# EAGLE board loa_carrier_motorcontrol (EAGLE 5.11), part 1 of 2
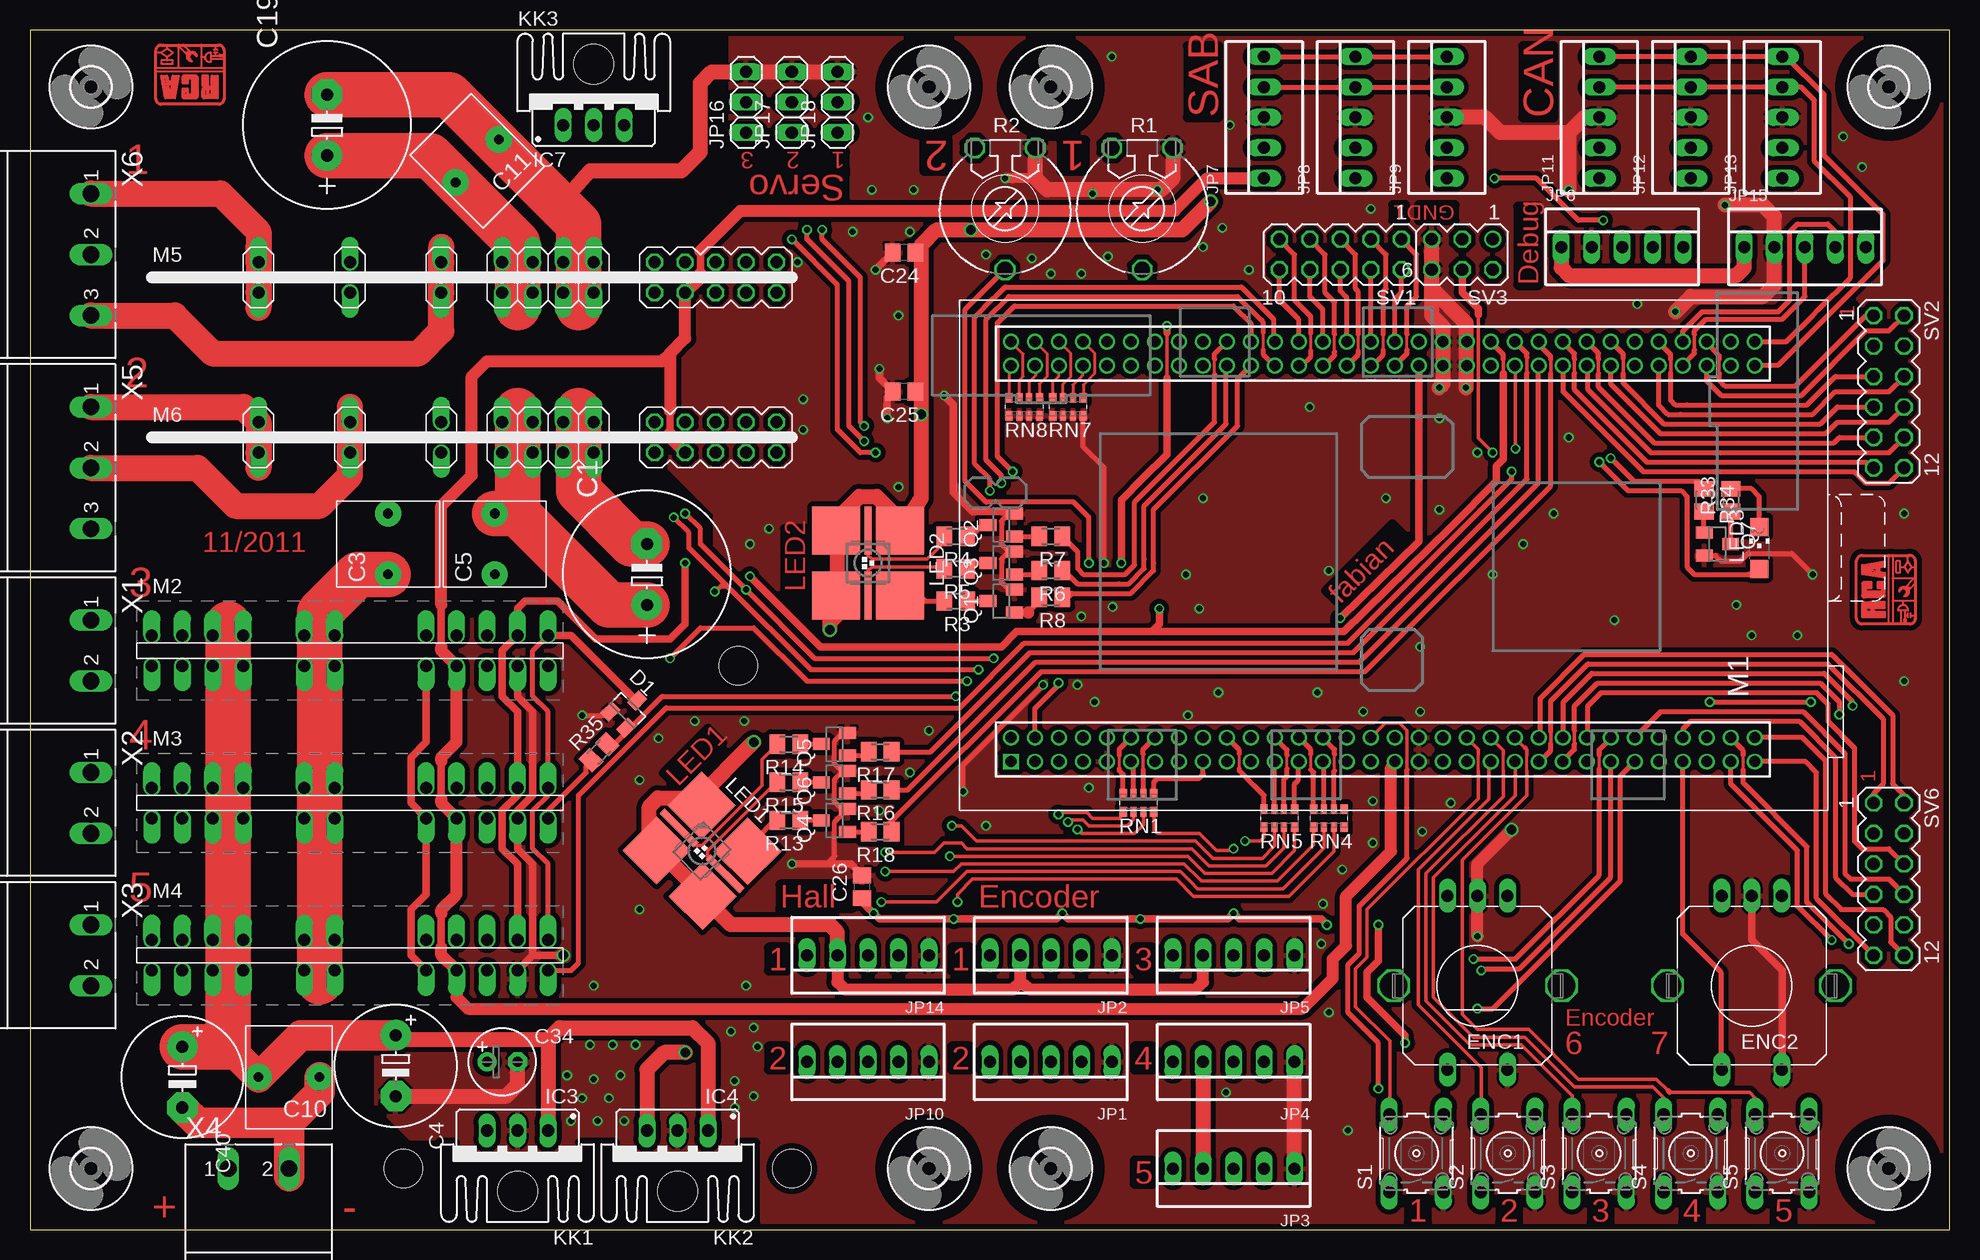
[diagram p7: board, top side]
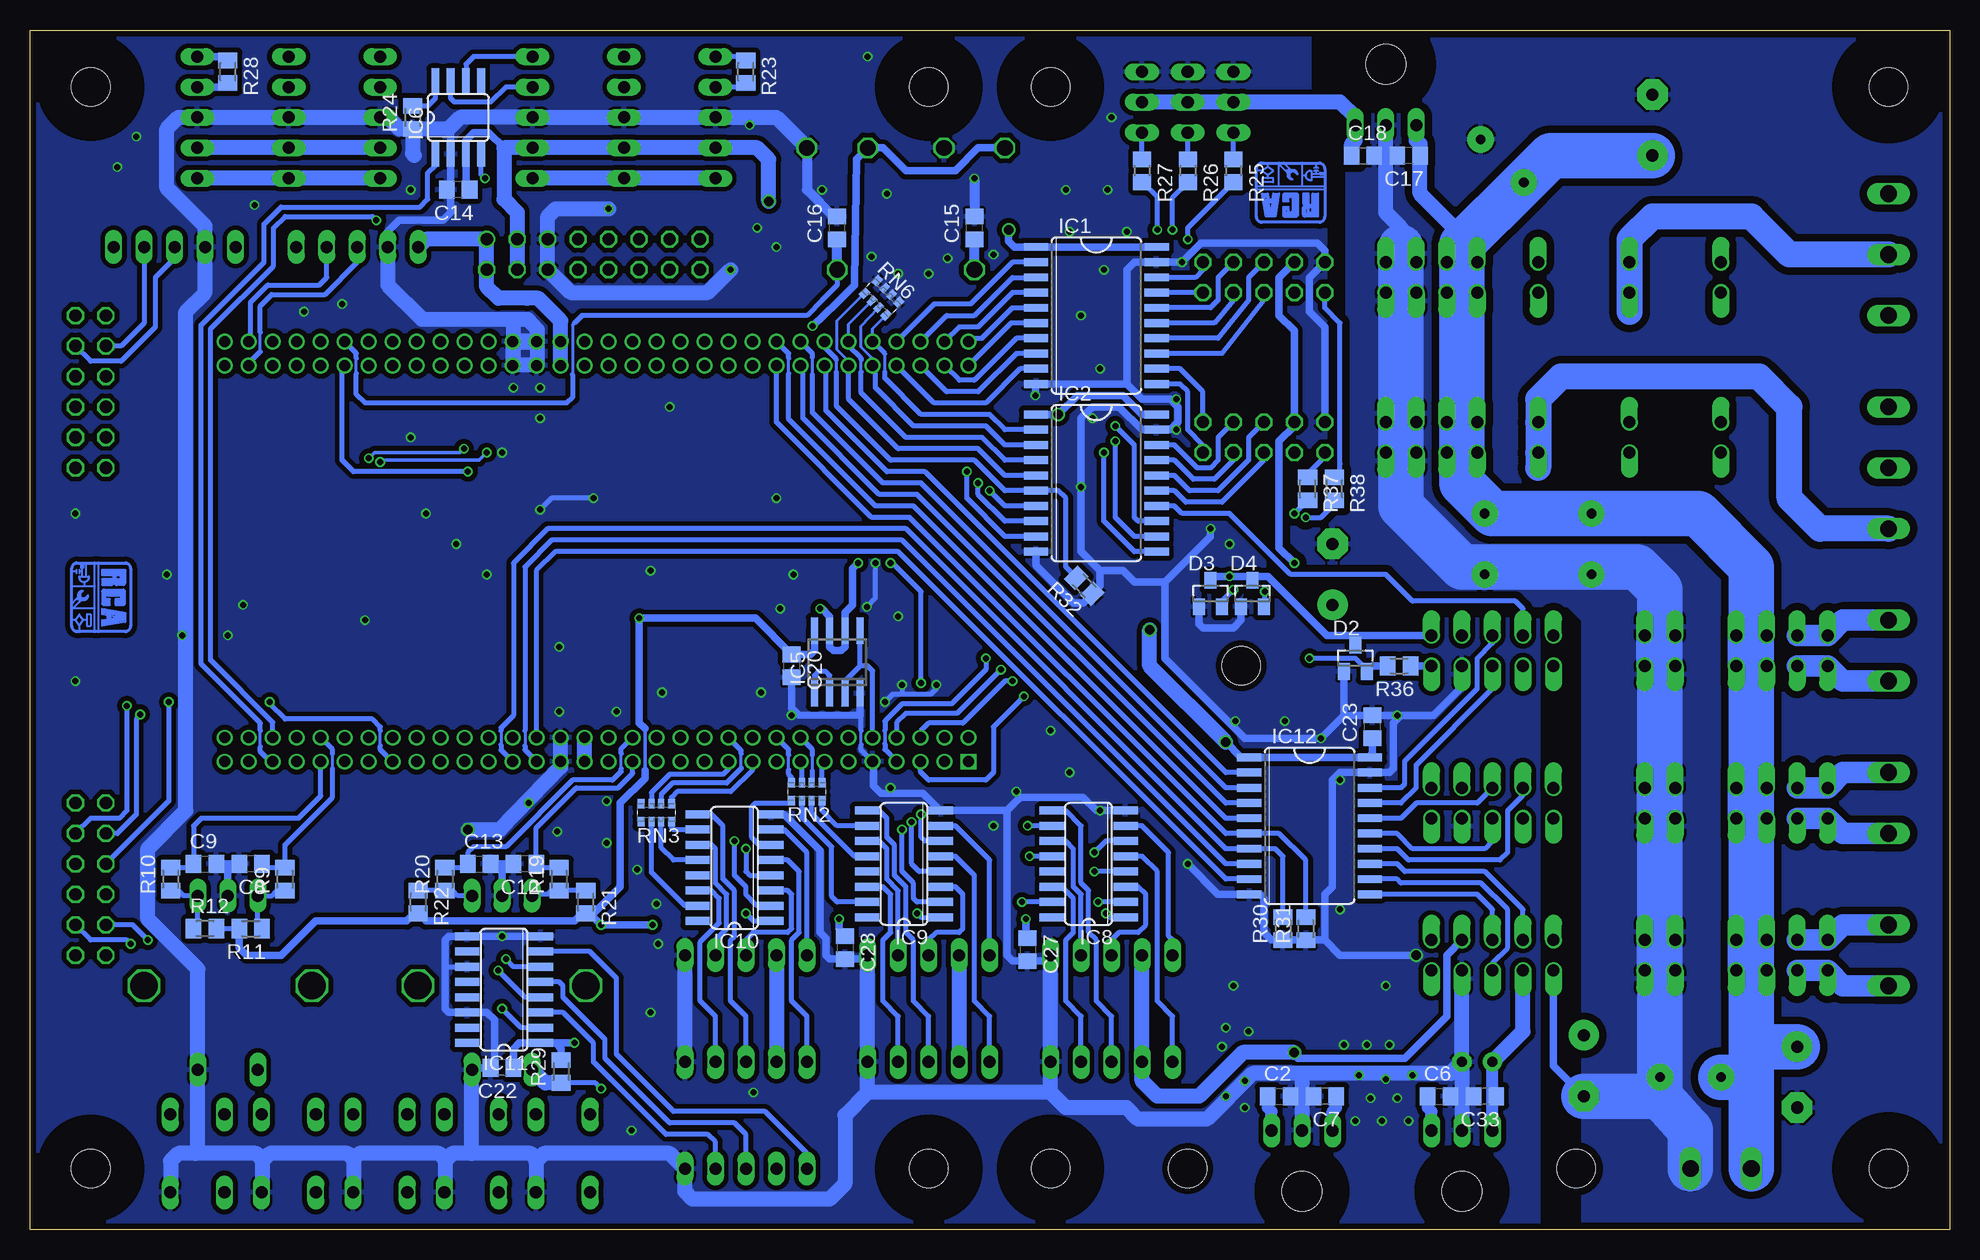
[diagram p8: board, bottom side, seen from below]

Size 160 x 100 mm. Coordinates in mm from the lower left corner, seen from the top.
Outline: 0,0 160,0 160,100 0,100 0,0
Copper layers (1*16): Top 0.035mm / dielectric 1.5mm / Bottom 0.035mm
Design rules "PCB-POOL": minimum track width 6mil, minimum drill 12mil, track to track 6mil, track to pad 6mil, pad to pad 6mil, via to via 6mil, smd to smd 6mil, copper to edge 20mil, drill to drill 8mil, minimum pad ring 8mil, minimum via ring 6mil, stop-mask expansion 3mil, vias tented up to drill 0mil, thermal gap 8mil
Holes 3.2 mm at 59.05,46.99 31.11,5.08 63.5,5.08
tRestrict: 2 lines

## Footprints (pad centres in the part's own frame; a part is rotated, then mirrored left to right if it is on the bottom)
E5-13 = drill 1.016 pad 2.54 round: + -2.54,0 | drill 1.016 pad 2.54 octagon: - 2.54,0
C0805 = smd 1.3 x 1.5: 1 -0.95,0; 2 0.95,0
MKS-2-8572 = drill 0.8 pad 2.184 round: 1 0,2.54; 2 0,-2.54
E5-10,5 = drill 1.016 pad 2.54 round: + -2.54,0 | drill 1.016 pad 2.54 octagon: - 2.54,0
E2,5-6 = drill 0.813 pad 1.6 round: + -1.27,0 | drill 0.813 pad 1.6 octagon: - 1.27,0
SOT23 = smd 1 x 1.4: 1 -0.95,-1.1; 2 0.95,-1.1; 3 0,1.1
EC12E24244 = drill 1 long: A -2.5,-7.5; B 2.5,-7.5; C 0,-7.5; D -2.5,7; E 2.5,7 | drill 2.3 octagon: CASE1 -7,0; CASE2 7,0
SO20W = smd 0.66 x 2.032: 1 -5.715,-5.029; 2 -4.445,-5.029; 3 -3.175,-5.029; 4 -1.905,-5.029; 5 -0.635,-5.029; 6 0.635,-5.029; 7 1.905,-5.029; 8 3.175,-5.029; 9 4.445,-5.029; 10 5.715,-5.029; 11 5.715,5.029; 12 4.445,5.029; 13 3.175,5.029; 14 1.905,5.029; 15 0.635,5.029; 16 -0.635,5.029; 17 -1.905,5.029; 18 -3.175,5.029; 19 -4.445,5.029; 20 -5.715,5.029
78XXS = drill 1.016 long: GND 0,-2.54; IN -2.54,-2.54; OUT 2.54,-2.54
SO08 = smd 0.6 x 2.2: 1 -1.905,-2.6; 2 -0.635,-2.6; 3 0.635,-2.6; 4 1.905,-2.6; 5 1.905,2.6; 6 0.635,2.6; 7 -0.635,2.6; 8 -1.905,2.6
SOIC-8 = smd 2.032 x 0.66: 1 -3.073,1.27; 2 -3.073,0; 3 -3.073,-1.27; 4 -3.073,-2.54; 5 3.073,-2.54; 6 3.073,-1.27; 7 3.073,0; 8 3.073,1.27
SO16 = smd 0.66 x 2.032: 1 -4.445,-3.073; 2 -3.175,-3.073; 3 -1.905,-3.073; 4 -0.635,-3.073; 5 0.635,-3.073; 6 1.905,-3.073; 7 3.175,-3.073; 8 4.445,-3.073; 9 4.445,3.073; 10 3.175,3.073; 11 1.905,3.073; 12 0.635,3.073; 13 -0.635,3.073; 14 -1.905,3.073; 15 -3.175,3.073; 16 -4.445,3.073
22-23-2051 = drill 1 long: 1 -5.08,0; 2 -2.54,0; 3 0,0; 4 2.54,0; 5 5.08,0
1X03 = drill 1.016 long: 1 -2.54,0; 2 0,0; 3 2.54,0
SK95-2M3 = hole 3.302: 0,2.54
P-LCC-6 = smd 4 x 4: 1 -2.65,-2.7; 3 2.65,-2.7; 4 2.65,2.7; 6 -2.65,2.7 | smd 0.6 x 4: 2 0,-2.7; 5 0,2.7
CHIPLED_1206 = smd 1.5 x 1.5: A 0,-1.75; C 0,1.75
CONTROL = drill 0.914 square: 1 4.08,68.1 | drill 0.914 round: 2 6.08,68.1; 3 4.08,66.1; 4 6.08,66.1; 5 4.08,64.1; 6 6.08,64.1; 7 4.08,62.1; 8 6.08,62.1; 9 4.08,60.1; 10 6.08,60.1; 11 4.08,58.1; 12 6.08,58.1; 13 4.08,56.1; 14 6.08,56.1; 15 4.08,54.1; 16 6.08,54.1; 17 4.08,52.1; 18 6.08,52.1; 19 4.08,50.1; 20 6.08,50.1; 21 4.08,48.1; 22 6.08,48.1; 23 4.08,46.1; 24 6.08,46.1; 25 4.08,44.1; 26 6.08,44.1; 27 4.08,42.1; 28 6.08,42.1; 29 4.08,40.1; 30 6.08,40.1; 31 4.08,38.1; 32 6.08,38.1; 33 4.08,36.1; 34 6.08,36.1; 35 4.08,34.1; 36 6.08,34.1; 37 4.08,32.1; 38 6.08,32.1; 39 4.08,30.1; 40 6.08,30.1; 41 4.08,28.1; 42 6.08,28.1; 43 4.08,26.1; 44 6.08,26.1; 45 4.08,24.1; 46 6.08,24.1; 47 4.08,22.1; 48 6.08,22.1; 49 4.08,20.1; 50 6.08,20.1; 51 4.08,18.1; 52 6.08,18.1; 53 4.08,16.1; 54 6.08,16.1; 55 4.08,14.1; 56 6.08,14.1; 57 4.08,12.1; 58 6.08,12.1; 59 4.08,10.1; 60 6.08,10.1; 61 4.08,8.1; 62 6.08,8.1; 63 4.08,6.1; 64 6.08,6.1; 65 37.1,68.1; 66 39.1,68.1; 67 37.1,66.1; 68 39.1,66.1; 69 37.1,64.1; 70 39.1,64.1; 71 37.1,62.1; 72 39.1,62.1; 73 37.1,60.1; 74 39.1,60.1; 75 37.1,58.1; 76 39.1,58.1; 77 37.1,56.1; 78 39.1,56.1; 79 37.1,54.1; 80 39.1,54.1; 81 37.1,52.1; 82 39.1,52.1; 83 37.1,50.1; 84 39.1,50.1; 85 37.1,48.1; 86 39.1,48.1; 87 37.1,46.1; 88 39.1,46.1; 89 37.1,44.1; 90 39.1,44.1; 91 37.1,42.1; 92 39.1,42.1; 93 37.1,40.1; 94 39.1,40.1; 95 37.1,38.1; 96 39.1,38.1; 97 37.1,36.1; 98 39.1,36.1; 99 37.1,34.1; 100 39.1,34.1; 101 37.1,32.1; 102 39.1,32.1; 103 37.1,30.1; 104 39.1,30.1; 105 37.1,28.1; 106 39.1,28.1; 107 37.1,26.1; 108 39.1,26.1; 109 37.1,24.1; 110 39.1,24.1; 111 37.1,22.1; 112 39.1,22.1; 113 37.1,20.1; 114 39.1,20.1; 115 37.1,18.1; 116 39.1,18.1; 117 37.1,16.1; 118 39.1,16.1; 119 37.1,14.1; 120 39.1,14.1; 121 37.1,12.1; 122 39.1,12.1; 123 37.1,10.1; 124 39.1,10.1; 125 37.1,8.1; 126 39.1,8.1; 127 37.1,6.1; 128 39.1,6.1
IRF7413_SIDEWARDS = drill 1 offset: 1 0,0; 2 2.54,0; 3 5.08,0; 4 7.62,0; 6 12.7,0; 7 15.24,0; 10 22.86,0; 11 25.4,0; 12 27.94,0; 13 30.48,0; 14 33.02,0; 15 33.02,2.54; 16 30.48,2.54; 17 27.94,2.54; 18 25.4,2.54; 19 22.86,2.54; 22 15.24,2.54; 23 12.7,2.54; 25 7.62,2.54; 26 5.08,2.54; 27 2.54,2.54; 28 0,2.54
BRUSHLESS_DRIVER = drill 1 offset: 1 8.89,-1.27; 4 16.51,-1.27; 7 24.13,-1.27; 9 29.21,-1.27; 10 31.75,-1.27; 11 34.29,-1.27; 12 36.83,-1.27; 25 36.83,1.27; 26 34.29,1.27; 27 31.75,1.27; 28 29.21,1.27; 30 24.13,1.27; 33 16.51,1.27; 36 8.89,1.27 | drill 1 octagon: 14 41.91,-1.27; 15 44.45,-1.27; 16 46.99,-1.27; 17 49.53,-1.27; 18 52.07,-1.27; 19 52.07,1.27; 20 49.53,1.27; 21 46.99,1.27; 22 44.45,1.27; 23 41.91,1.27
LI10 = drill 1.321 octagon: A -2.54,-5.08; E 2.54,-5.08; S 0,5.08
M0805 = smd 1.3 x 1.6: 1 -0.95,0; 2 0.95,0
R0805 = smd 1.3 x 1.5: 1 -0.95,0; 2 0.95,0
EXB38V = smd 0.6 x 0.8: 1 -1.275,-0.75; 4 1.275,-0.75; 5 1.275,0.75; 8 -1.275,0.75 | smd 0.5 x 0.8: 2 -0.4,-0.75; 3 0.4,-0.75; 6 0.4,0.75; 7 -0.4,0.75
B3F-10XX = drill 1.016 long: 1 -3.251,2.261; 2 3.251,2.261; 3 -3.251,-2.261; 4 3.251,-2.261
MA05-2 = drill 1.016 octagon: 1 -5.08,-1.27; 2 -5.08,1.27; 3 -2.54,-1.27; 4 -2.54,1.27; 5 0,-1.27; 6 0,1.27; 7 2.54,-1.27; 8 2.54,1.27; 9 5.08,-1.27; 10 5.08,1.27
MA06-2 = drill 1.016 octagon: 1 -6.35,-1.27; 2 -6.35,1.27; 3 -3.81,-1.27; 4 -3.81,1.27; 5 -1.27,-1.27; 6 -1.27,1.27; 7 1.27,-1.27; 8 1.27,1.27; 9 3.81,-1.27; 10 3.81,1.27; 11 6.35,-1.27; 12 6.35,1.27
MA03-2 = drill 1.016 round: 1 -2.54,-1.27 | drill 1.016 octagon: 2 -2.54,1.27; 3 0,-1.27; 4 0,1.27; 5 2.54,-1.27; 6 2.54,1.27
3,2 = hole 3.2: 0,0
MSTBA2 = drill 1.397 long: 1 -2.54,5.08; 2 2.54,5.08
MSTBA3 = drill 1.397 long: 1 -5.08,5.08; 2 0,5.08; 3 5.08,5.08

## Placement (x,y rotation side)
C1  470µ  [E5-13]  51.44,54.61 90 top
C2  100n  [C0805]  55.88,11.11 0 bottom
C3  6,8µ  [MKS-2-8572]  29.84,57.15 0 top
C4  220µ  [E5-10,5]  30.48,13.65 270 top
C5  6,8µ  [MKS-2-8572]  38.73,57.15 0 top
C6  100n  [C0805]  42.55,11.11 0 bottom
C7  100n  [C0805]  52.07,11.11 180 bottom
C8  10n  [C0805]  141.6,30.48 180 bottom
C9  10n  [C0805]  145.41,30.48 0 bottom
C10  6,8µ  [MKS-2-8572]  21.59,12.7 90 top
C11  6,8µ  [MKS-2-8572]  37.28,89.09 135 top
C12  10n  [C0805]  118.75,30.48 180 bottom
C13  10n  [C0805]  122.56,30.48 0 bottom
C14  100n  [C0805]  124.3,86.68 180 bottom
C15  100n  [C0805]  81.28,83.5 90 bottom
C16  100n  [C0805]  92.71,83.5 90 bottom
C17  100n  [C0805]  45.09,89.53 180 bottom
C18  100n  [C0805]  48.9,89.53 0 bottom
C19  470µ  [E5-13]  24.77,92.08 90 top
C20  100n  [C0805]  96.52,46.99 270 bottom
C22  100n  [C0805]  120.65,13.49 180 bottom
C23  100n  [C0805]  48.1,41.91 90 bottom
C24  100n  [C0805]  72.87,81.44 180 top
C25  100n  [C0805]  72.87,69.85 180 top
C26  100n  [C0805]  69.37,28.57 90 top
C27  100n  [C0805]  76.83,23.34 270 bottom
C28  100n  [C0805]  92.08,23.5 270 bottom
C33  100n  [C0805]  38.73,11.11 180 bottom
C34  22µ  [E2,5-6]  39.37,13.97 0 top
C40  220µ  [E5-10,5]  12.7,12.7 270 top
D1  BAT54S  [SOT23]  49.83,43.29 315 top
D2  BAT54S  [SOT23]  49.53,47.62 0 bottom
D3  BAT54S  [SOT23]  61.59,53.02 0 bottom
D4  BAT54S  [SOT23]  58.1,53.02 0 bottom
ENC1  ENCODER  [EC12E24244]  120.65,20.32 180 top
ENC2  ENCODER  [EC12E24244]  143.51,20.32 180 top
IC1  74HCT245DW  [SO20W]  71.12,76.2 270 bottom
IC2  74HCT245DW  [SO20W]  71.12,62.23 270 bottom
IC3  7815  [78XXS]  40.64,5.71 180 top
IC4  7805  [78XXS]  53.98,5.71 180 top
IC5  LM358D  [SO08]  92.71,47.31 0 bottom
IC6  MCP2551SN  [SOIC-8]  124.94,92.71 90 bottom
IC7  7805  [78XXS]  46.99,94.61 0 top
IC8  4050D  [SO16]  71.75,30.48 90 bottom
IC9  4050D  [SO16]  87.15,30.48 90 bottom
IC10  4050D  [SO16]  101.28,30.16 90 bottom
IC11  4050D  [SO16]  120.49,20 90 bottom
IC12  74HCT245DW  [SO20W]  53.34,33.66 270 bottom
JP1  Encoder 2  [22-23-2051]  85.09,13.97 180 top
JP2  Encoder 1  [22-23-2051]  85.09,22.86 180 top
JP3  Encoder 5  [22-23-2051]  100.33,5.08 180 top
JP4  Encoder 4  [22-23-2051]  100.33,13.97 180 top
JP5  Encoder 3  [22-23-2051]  100.33,22.86 180 top
JP6  Debug  [22-23-2051]  132.72,81.92 0 top
JP7  SABV  [22-23-2051]  102.87,92.71 90 top
JP8  SABV  [22-23-2051]  110.49,92.71 90 top
JP9  SABV  [22-23-2051]  118.11,92.71 90 top
JP10  Hall Sensors 2  [22-23-2051]  69.85,13.97 180 top
JP11  SABV  [22-23-2051]  130.81,92.71 90 top
JP12  SABV  [22-23-2051]  138.43,92.71 90 top
JP13  SABV  [22-23-2051]  146.05,92.71 90 top
JP14  Hall Sensors 1  [22-23-2051]  69.85,22.86 180 top
JP15  Uplink  [22-23-2051]  147.96,81.92 0 top
JP16  Servo 3  [1X03]  59.69,93.98 90 top
JP17  Servo 2  [1X03]  63.5,93.98 90 top
JP18  Servo 1  [1X03]  67.31,93.98 90 top
KK1  V PR5/25-M3  [SK95-2M3]  40.64,5.71 180 top
KK2  V PR5/25-M3  [SK95-2M3]  53.98,5.71 180 top
KK3  V PR5/25-M3  [SK95-2M3]  46.99,94.61 0 top
LED1  [P-LCC-6]  56.02,31.57 225 top
LED2  [P-LCC-6]  69.85,55.56 180 top
LED3  Blue  [CHIPLED_1206]  144.15,56.83 0 top
M1  DAMBALLAH  [CONTROL]  149.86,34.92 90 top
M2  DC Motor 3  [IRF7413_SIDEWARDS]  10.16,46.99 0 top
M3  DC Motor 4  [IRF7413_SIDEWARDS]  10.16,34.29 0 top
M4  DC Motor 5  [IRF7413_SIDEWARDS]  10.16,21.59 0 top
M5  Brushless Driver 1  [BRUSHLESS_DRIVER]  10.16,79.38 0 top
M6  Brushless Driver 2  [BRUSHLESS_DRIVER]  10.16,66.04 0 top
Q1  BC847SMD  [SOT23]  80.96,52.39 90 top
Q2  BC847SMD  [SOT23]  80.96,58.74 90 top
Q3  BC847SMD  [SOT23]  80.96,55.56 90 top
Q4  BC847SMD  [SOT23]  67.06,34.11 90 top
Q5  BC847SMD  [SOT23]  67.06,40.46 90 top
Q6  BC847SMD  [SOT23]  67.06,37.29 90 top
Q7  BC847SMD  [SOT23]  140.65,57.15 270 top
R1  10k  [LI10]  92.71,85.09 180 top
R2  10k  [LI10]  81.28,85.09 180 top
R3  120  [M0805]  77.15,52.39 180 top
R4  82  [M0805]  77.15,57.78 180 top
R5  82  [M0805]  77.15,55.09 180 top
R6  1k  [M0805]  85.09,54.93 180 top
R7  1k  [M0805]  85.09,57.78 180 top
R8  1k  [M0805]  85.09,52.7 180 top
R9  10k  [M0805]  138.75,29.21 90 bottom
R10  10k  [M0805]  148.27,29.21 90 bottom
R11  10k  [M0805]  141.6,25.08 180 bottom
R12  10k  [M0805]  145.41,25.08 0 bottom
R13  120  [M0805]  63.25,34.11 180 top
R14  82  [M0805]  63.25,40.46 180 top
R15  82  [M0805]  63.25,37.29 180 top
R16  1k  [M0805]  70.87,36.65 180 top
R17  1k  [M0805]  70.87,39.83 180 top
R18  1k  [M0805]  70.87,33.16 180 top
R19  10k  [M0805]  115.89,29.21 90 bottom
R20  10k  [M0805]  125.41,29.21 90 bottom
R21  10k  [M0805]  113.67,27.3 270 bottom
R22  10k  [M0805]  127.64,27.3 270 bottom
R23  120  [M0805]  100.33,96.52 270 bottom
R24  1k  [M0805]  128.11,92.71 90 bottom
R25  100  [R0805]  59.69,88.27 270 bottom
R26  100  [R0805]  63.5,88.27 270 bottom
R27  100  [R0805]  67.31,88.27 270 bottom
R28  120  [M0805]  143.51,96.52 270 bottom
R29  10k  [M0805]  115.73,13.18 90 bottom
R30  10k  [M0805]  55.56,25.08 90 bottom
R31  10k  [M0805]  53.66,25.08 90 bottom
R32  10k  [M0805]  72.12,53.66 135 bottom
R33  82  [M0805]  141.76,60.8 90 top
R34  1k  [M0805]  139.54,60.8 270 top
R35  100  [M0805]  47.44,39.78 45 top
R36  100  [M0805]  45.88,46.99 180 bottom
R37  100  [M0805]  53.5,61.75 270 bottom
R38  100  [M0805]  51.28,61.75 270 bottom
RN1  100  [EXB38V]  92.39,35.56 180 top
RN2  100  [EXB38V]  95.25,36.51 180 bottom
RN3  100  [EXB38V]  107.79,34.77 180 bottom
RN4  100  [EXB38V]  108.27,34.29 180 top
RN5  100  [EXB38V]  104.14,34.29 180 top
RN6  10k  [EXB38V]  89.01,77.68 315 bottom
RN7  10k  [EXB38V]  86.52,68.58 180 top
RN8  10k  [EXB38V]  82.87,68.58 180 top
S1  [B3F-10XX]  115.57,6.35 90 top
S2  [B3F-10XX]  123.19,6.35 90 top
S3  [B3F-10XX]  130.81,6.35 90 top
S4  [B3F-10XX]  138.43,6.35 90 top
S5  [B3F-10XX]  146.05,6.35 90 top
SV1  [MA05-2]  109.22,81.28 180 top
SV2  [MA06-2]  154.94,69.85 270 top
SV3  [MA03-2]  119.38,81.28 180 top
SV6  [MA06-2]  154.94,29.21 270 top
U$1  [3,2]  5.08,5.08 0 top
U$2  [3,2]  74.93,5.08 0 top
U$3  [3,2]  85.09,5.08 0 top
U$4  [3,2]  154.94,5.08 0 top
U$5  [3,2]  5.08,95.25 0 top
U$6  [3,2]  74.93,95.25 0 top
U$7  [3,2]  85.09,95.25 0 top
U$8  [3,2]  154.94,95.25 0 top
U$9  [LOGO]  13.34,96.2 180 top
U$10  [LOGO]  154.62,53.34 90 top
U$11  [LOGO]  54.93,86.36 180 bottom
U$12  [LOGO]  153.99,52.7 270 bottom
X1  MSTBA2  [MSTBA2]  0,48.26 270 top
X2  MSTBA2  [MSTBA2]  0,35.56 270 top
X3  MSTBA2  [MSTBA2]  0,22.86 270 top
X4  MSTBA2  [MSTBA2]  19.05,0 0 top
X5  MSTBA3  [MSTBA3]  0,63.5 270 top
X6  MSTBA3  [MSTBA3]  0,81.28 270 top